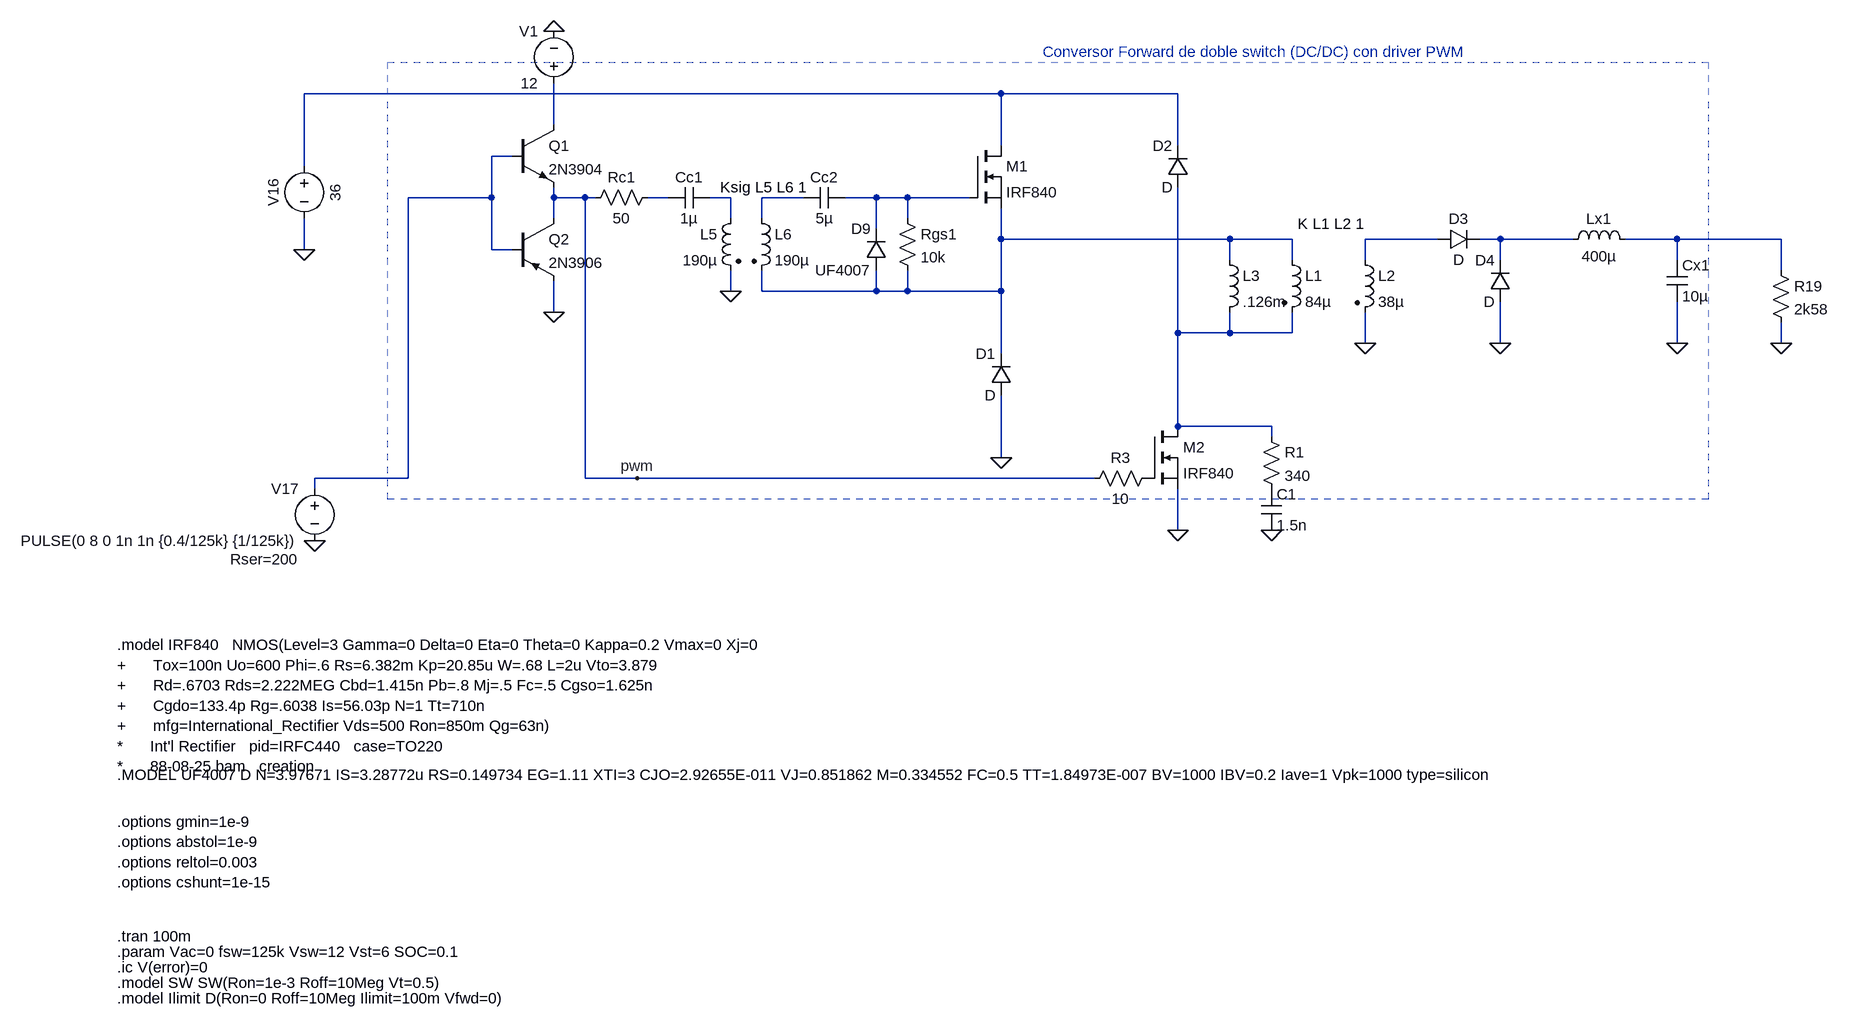
[diagram p0: schematic Forward-pwm-v4-basico.asc]
Forward-pwm-v4-basico.asc, the LTspice schematic file:
Version 4
SHEET 1 4052 1524
WIRE -448 -480 -1520 -480
WIRE -176 -480 -448 -480
WIRE -1136 -432 -1136 -496
WIRE -448 -400 -448 -480
WIRE -176 -400 -176 -480
WIRE -1200 -384 -1232 -384
WIRE -1520 -368 -1520 -480
WIRE -1232 -320 -1232 -384
WIRE -1232 -320 -1360 -320
WIRE -1136 -320 -1136 -336
WIRE -1088 -320 -1136 -320
WIRE -1072 -320 -1088 -320
WIRE -960 -320 -992 -320
WIRE -864 -320 -896 -320
WIRE -752 -320 -816 -320
WIRE -640 -320 -688 -320
WIRE -592 -320 -640 -320
WIRE -496 -320 -592 -320
WIRE -1136 -288 -1136 -320
WIRE -864 -288 -864 -320
WIRE -816 -288 -816 -320
WIRE -592 -288 -592 -320
WIRE -640 -272 -640 -320
WIRE -448 -256 -448 -304
WIRE -96 -256 -448 -256
WIRE 0 -256 -96 -256
WIRE 224 -256 112 -256
WIRE 320 -256 288 -256
WIRE 432 -256 320 -256
WIRE 592 -256 512 -256
WIRE 752 -256 592 -256
WIRE -1520 -240 -1520 -288
WIRE -1232 -240 -1232 -320
WIRE -1200 -240 -1232 -240
WIRE -96 -224 -96 -256
WIRE 0 -224 0 -256
WIRE 112 -224 112 -256
WIRE 320 -224 320 -256
WIRE 592 -224 592 -256
WIRE 752 -208 752 -256
WIRE -864 -176 -864 -208
WIRE -816 -176 -816 -208
WIRE -640 -176 -640 -208
WIRE -640 -176 -816 -176
WIRE -592 -176 -592 -208
WIRE -592 -176 -640 -176
WIRE -448 -176 -448 -256
WIRE -448 -176 -592 -176
WIRE -1136 -144 -1136 -192
WIRE -176 -112 -176 -336
WIRE -96 -112 -96 -144
WIRE -96 -112 -176 -112
WIRE 0 -112 0 -144
WIRE 0 -112 -96 -112
WIRE 112 -96 112 -144
WIRE 320 -96 320 -160
WIRE 592 -96 592 -160
WIRE 752 -96 752 -128
WIRE -448 -80 -448 -176
WIRE -176 32 -176 -112
WIRE -32 32 -176 32
WIRE -32 48 -32 32
WIRE -448 80 -448 -16
WIRE -1360 112 -1360 -320
WIRE -1360 112 -1504 112
WIRE -1088 112 -1088 -320
WIRE -1008 112 -1088 112
WIRE -304 112 -1008 112
WIRE -1504 128 -1504 112
WIRE -176 192 -176 128
FLAG 112 -96 0
FLAG 320 -96 0
FLAG 592 -96 0
FLAG -176 192 0
FLAG -448 80 0
FLAG -1008 112 pwm
FLAG -1520 -240 0
FLAG -864 -176 0
FLAG -1504 208 0
FLAG 752 -96 0
FLAG -1136 -144 0
FLAG -1136 -576 0
FLAG -32 192 0
SYMBOL ind2 -16 -240 R0
SYMATTR InstName L1
SYMATTR Value 84µ
SYMATTR Type ind
SYMBOL ind2 96 -240 R0
SYMATTR InstName L2
SYMATTR Value 38µ
SYMATTR Type ind
SYMBOL ind 416 -240 R270
WINDOW 0 32 56 VTop 2
WINDOW 3 5 56 VBottom 2
SYMATTR InstName Lx1
SYMATTR Value 400µ
SYMATTR SpiceLine Rser=20m
SYMBOL cap 576 -224 R0
SYMATTR InstName Cx1
SYMATTR Value 10µ
SYMATTR SpiceLine Rser=0
SYMBOL nmos -224 32 R0
SYMATTR InstName M2
SYMATTR Value IRF840
SYMBOL diode -432 -16 R180
WINDOW 0 24 64 Left 2
WINDOW 3 24 0 Left 2
SYMATTR InstName D1
SYMBOL diode -160 -336 R180
WINDOW 0 24 64 Left 2
WINDOW 3 24 0 Left 2
SYMATTR InstName D2
SYMBOL diode 224 -240 R270
WINDOW 0 32 32 VTop 2
WINDOW 3 0 32 VBottom 2
SYMATTR InstName D3
SYMBOL diode 336 -160 R180
WINDOW 0 24 64 Left 2
WINDOW 3 24 0 Left 2
SYMATTR InstName D4
SYMBOL ind -112 -240 R0
SYMATTR InstName L3
SYMATTR Value .126m
SYMBOL voltage -1520 -384 R0
WINDOW 0 -32 56 VBottom 2
WINDOW 3 32 56 VTop 2
WINDOW 123 0 0 Left 0
WINDOW 39 0 0 Left 0
SYMATTR InstName V16
SYMATTR Value 36
SYMBOL res -976 -336 R90
WINDOW 0 0 56 VBottom 2
WINDOW 3 32 56 VTop 2
SYMATTR InstName Rc1
SYMATTR Value 50
SYMBOL cap -896 -336 R90
WINDOW 0 0 32 VBottom 2
WINDOW 3 32 32 VTop 2
SYMATTR InstName Cc1
SYMATTR Value 1µ
SYMBOL ind2 -848 -304 M0
SYMATTR InstName L5
SYMATTR Value 190µ
SYMATTR Type ind
SYMBOL ind2 -832 -304 R0
SYMATTR InstName L6
SYMATTR Value 190µ
SYMATTR Type ind
SYMBOL cap -752 -336 M90
WINDOW 0 0 32 VBottom 2
WINDOW 3 32 32 VTop 2
SYMATTR InstName Cc2
SYMATTR Value 5µ
SYMBOL diode -624 -208 R180
WINDOW 0 24 64 Left 2
WINDOW 3 24 0 Left 2
SYMATTR InstName D9
SYMATTR Value UF4007
SYMBOL res -608 -304 R0
SYMATTR InstName Rgs1
SYMATTR Value 10k
SYMBOL nmos -496 -400 R0
SYMATTR InstName M1
SYMATTR Value IRF840
SYMBOL voltage -1504 112 M0
WINDOW 123 0 0 Left 0
WINDOW 39 24 124 Left 2
SYMATTR SpiceLine Rser=200
SYMATTR InstName V17
SYMATTR Value PULSE(0 8 0 1n 1n {0.4/125k} {1/125k})
SYMBOL res 736 -224 R0
SYMATTR InstName R19
SYMATTR Value 2k58
SYMBOL npn -1200 -432 R0
SYMATTR InstName Q1
SYMATTR Value 2N3904
SYMBOL pnp -1200 -288 R0
SYMATTR InstName Q2
SYMATTR Value 2N3906
SYMBOL voltage -1136 -480 R180
WINDOW 0 24 96 Left 2
WINDOW 3 24 16 Left 2
WINDOW 123 0 0 Left 0
WINDOW 39 0 0 Left 0
SYMATTR InstName V1
SYMATTR Value 12
SYMBOL res -48 32 R0
SYMATTR InstName R1
SYMATTR Value 340
SYMBOL cap -48 128 R0
SYMATTR InstName C1
SYMATTR Value 1.5n
SYMBOL res -208 96 R90
WINDOW 0 0 56 VBottom 2
WINDOW 3 32 56 VTop 2
SYMATTR InstName R3
SYMATTR Value 10
TEXT 8 -280 Left 2 !K L1 L2 1
TEXT -1808 816 Left 2 !.tran 100m
TEXT -1808 840 Left 2 !.param Vac=0 fsw=125k Vsw=12 Vst=6 SOC=0.1
TEXT -1808 864 Left 2 !.ic V(error)=0
TEXT -1808 888 Left 2 !.model SW SW(Ron=1e-3 Roff=10Meg Vt=0.5)
TEXT -384 -544 Left 2 ;Conversor Forward de doble switch (DC/DC) con driver PWM
TEXT -1808 640 Left 2 !.options gmin=1e-9\n.options abstol=1e-9\n.options reltol=0.003\n.options cshunt=1e-15
TEXT -1808 912 Left 2 !.model Ilimit D(Ron=0 Roff=10Meg Ilimit=100m Vfwd=0)
TEXT -880 -336 Left 2 !Ksig L5 L6 1
TEXT -1808 568 Left 2 !.MODEL UF4007 D N=3.97671 IS=3.28772u RS=0.149734 EG=1.11 XTI=3 CJO=2.92655E-011 VJ=0.851862 M=0.334552 FC=0.5 TT=1.84973E-007 BV=1000 IBV=0.2 Iave=1 Vpk=1000 type=silicon
TEXT -1808 368 Left 2 !.model IRF840   NMOS(Level=3 Gamma=0 Delta=0 Eta=0 Theta=0 Kappa=0.2 Vmax=0 Xj=0\n+      Tox=100n Uo=600 Phi=.6 Rs=6.382m Kp=20.85u W=.68 L=2u Vto=3.879\n+      Rd=.6703 Rds=2.222MEG Cbd=1.415n Pb=.8 Mj=.5 Fc=.5 Cgso=1.625n\n+      Cgdo=133.4p Rg=.6038 Is=56.03p N=1 Tt=710n\n+      mfg=International_Rectifier Vds=500 Ron=850m Qg=63n)\n*      Int'l Rectifier   pid=IRFC440   case=TO220\n*      88-08-25 bam   creation
RECTANGLE Normal 640 144 -1392 -528 2

The netlist it stands for:
* Forward-pwm-v4-basico.asc
L1 N008 N012 84µ
L2 N009 0 38µ
Lx1 N010 N011 400µ Rser=20m
Cx1 N011 0 10µ Rser=0
M2 N012 P001 0 0 IRF840
D1 0 N008 D
D2 N012 N001 D
D3 N009 N010 D
D4 0 N010 D
L3 N008 N012 .126m
V16 N001 0 36
Rc1 N004 pwm 50
Cc1 N005 N004 1µ
L5 N005 0 190µ
L6 N006 N008 190µ
Cc2 N006 N007 5µ
D9 N008 N007 UF4007
Rgs1 N007 N008 10k
M1 N001 N007 N008 N008 IRF840
V17 N003 0 PULSE(0 8 0 1n 1n {0.4/125k} {1/125k}) Rser=200
R19 N011 0 2k58
Q1 N002 N003 pwm 0 2N3904
Q2 pwm N003 0 0 2N3906
V1 N002 0 12
R1 N012 P002 340
C1 P002 0 1.5n
R3 P001 pwm 10
.model D D
.lib standard.dio
.model NPN NPN
.model PNP PNP
.lib standard.bjt
.model NMOS NMOS
.model PMOS PMOS
.lib standard.mos
K L1 L2 1
.tran 100m
.param Vac=0 fsw=125k Vsw=12 Vst=6 SOC=0.1
.ic V(error)=0
.model SW SW(Ron=1e-3 Roff=10Meg Vt=0.5)
* Conversor Forward de doble switch (DC/DC) con driver PWM
.options gmin=1e-9
.options abstol=1e-9
.options reltol=0.003
.options cshunt=1e-15
.model Ilimit D(Ron=0 Roff=10Meg Ilimit=100m Vfwd=0)
Ksig L5 L6 1
.MODEL UF4007 D N=3.97671 IS=3.28772u RS=0.149734 EG=1.11 XTI=3 CJO=2.92655E-011 VJ=0.851862 M=0.334552 FC=0.5 TT=1.84973E-007 BV=1000 IBV=0.2 Iave=1 Vpk=1000 type=silicon
.model IRF840   NMOS(Level=3 Gamma=0 Delta=0 Eta=0 Theta=0 Kappa=0.2 Vmax=0 Xj=0
+      Tox=100n Uo=600 Phi=.6 Rs=6.382m Kp=20.85u W=.68 L=2u Vto=3.879
+      Rd=.6703 Rds=2.222MEG Cbd=1.415n Pb=.8 Mj=.5 Fc=.5 Cgso=1.625n
+      Cgdo=133.4p Rg=.6038 Is=56.03p N=1 Tt=710n
+      mfg=International_Rectifier Vds=500 Ron=850m Qg=63n)
*      Int'l Rectifier   pid=IRFC440   case=TO220
*      88-08-25 bam   creation
.backanno
.end